# Altium schematic sheet barrido.SchDoc
size A
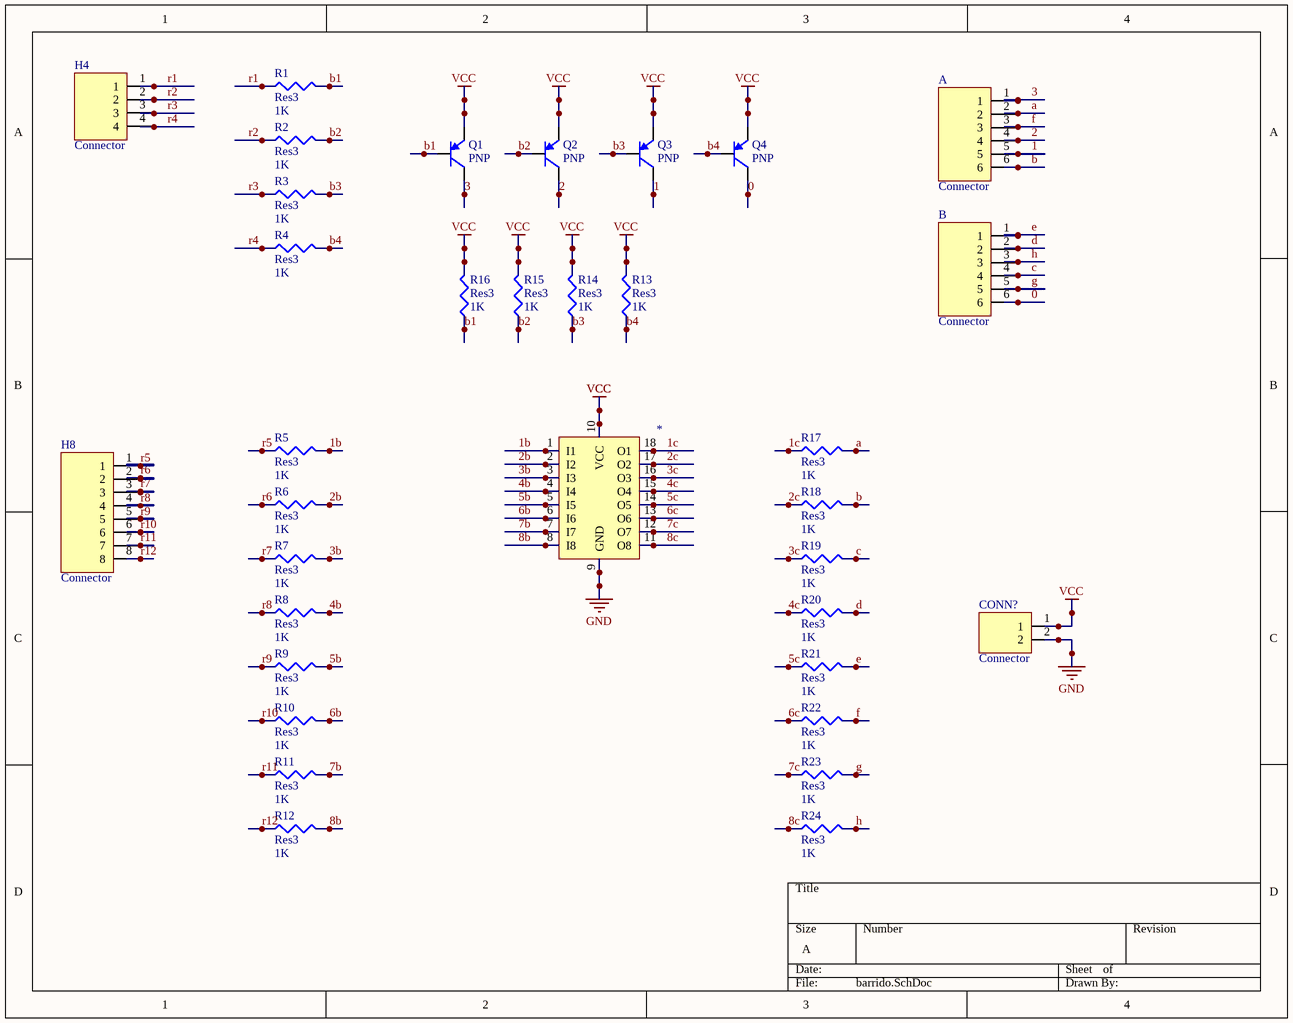
[diagram p0: barrido.SchDoc]

## Parts
*  uln2803  [*SO18L]  (value not drawn)
A  Connector  [1x6x2.54 Pin Header TH V]
B  Connector  [1x6x2.54 Pin Header TH V]
CONN?  Connector  [1x2x2.54 Pin Header TH V]
H4  Connector  [1x4x2.54 Pin Header TH V]
H8  Connector  [1x8x2.54 Pin Header TH V]
Q1  PNP  [SOT-23B_N]
Q2  PNP  [SOT-23B_N]
Q3  PNP  [SOT-23B_N]
Q4  PNP  [SOT-23B_N]
R1  Res3  value 1K  [J1-0603]
R2  Res3  value 1K  [J1-0603]
R3  Res3  value 1K  [J1-0603]
R4  Res3  value 1K  [J1-0603]
R5  Res3  value 1K  [J1-0603]
R6  Res3  value 1K  [J1-0603]
R7  Res3  value 1K  [J1-0603]
R8  Res3  value 1K  [J1-0603]
R9  Res3  value 1K  [J1-0603]
R10  Res3  value 1K  [J1-0603]
R11  Res3  value 1K  [J1-0603]
R12  Res3  value 1K  [J1-0603]
R13  Res3  value 1K  [J1-0603]
R14  Res3  value 1K  [J1-0603]
R15  Res3  value 1K  [J1-0603]
R16  Res3  value 1K  [J1-0603]
R17  Res3  value 1K  [J1-0603]
R18  Res3  value 1K  [J1-0603]
R19  Res3  value 1K  [J1-0603]
R20  Res3  value 1K  [J1-0603]
R21  Res3  value 1K  [J1-0603]
R22  Res3  value 1K  [J1-0603]
R23  Res3  value 1K  [J1-0603]
R24  Res3  value 1K  [J1-0603]

## Nets
GND: *.9(GND) CONN?.2
VCC: *.10(VCC) CONN?.1 Q1.3(E) Q2.3(E) Q3.3(E) Q4.3(E) R13.2 R14.2 R15.2 R16.2
0: B.6 Q4.1(C)
1: A.5 Q3.1(C)
1b: *.1(I1) R5.2
1c: *.18(O1) R17.1
2: A.4 Q2.1(C)
2b: *.2(I2) R6.2
2c: *.17(O2) R18.1
3: A.1 Q1.1(C)
3b: *.3(I3) R7.2
3c: *.16(O3) R19.1
4b: *.4(I4) R8.2
4c: *.15(O4) R20.1
5b: *.5(I5) R9.2
5c: *.14(O5) R21.1
6b: *.6(I6) R10.2
6c: *.13(O6) R22.1
7b: *.7(I7) R11.2
7c: *.12(O7) R23.1
8b: *.8(I8) R12.2
8c: *.11(O8) R24.1
a: A.2 R17.2
b: A.6 R18.2
b1: Q1.2(B) R1.2 R16.1
b2: Q2.2(B) R2.2 R15.1
b3: Q3.2(B) R3.2 R14.1
b4: Q4.2(B) R4.2 R13.1
c: B.4 R19.2
d: B.2 R20.2
e: B.1 R21.2
f: A.3 R22.2
g: B.5 R23.2
h: B.3 R24.2
r1: H4.1 R1.1
r2: H4.2 R2.1
r3: H4.3 R3.1
r4: H4.4 R4.1
r5: H8.1 R5.1
r6: H8.2 R6.1
r7: H8.3 R7.1
r8: H8.4 R8.1
r9: H8.5 R9.1
r10: H8.6 R10.1
r11: H8.7 R11.1
r12: H8.8 R12.1

## Library data of the parts
A B = Header 1x6
CONN? = Header 1x2
H4 = Header 1x4
H8 = Header 1x8
Q1-Q4 = PNP: PNP Bipolar Transistor; Published: 8-Jun-2000; LatestRevisionDate: 29-May-2009; LatestRevisionNote: IPC-7351 Footprint Added.; PackageVersion: Aug-1999; PackageReference: SOT-23B; Publisher: Altium Limited; PackageDescription: 3-Pin SOT-23 Package 0.95 mm Pitch, 2.4 mm Lead Span
R1-R24 = Res3: Resistor; Published: 8-Jun-2000; LatestRevisionDate: 29-May-2009; LatestRevisionNote: IPC-7351 Footprint Added.; PackageReference: J1-0603; Publisher: Altium Limited; PackageDescription: Chip Resistor